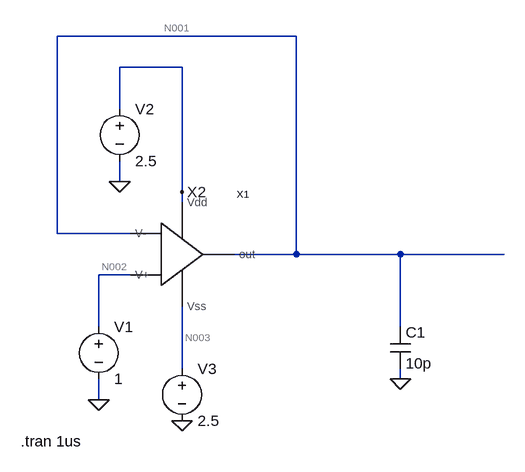
[diagram p0: schematic Draft7.asc]
Draft7.asc, the LTspice schematic file:
Version 4
SHEET 1 880 680
WIRE 400 -224 32 -224
WIRE 224 -176 128 -176
WIRE 128 -112 128 -176
WIRE 128 0 128 -32
WIRE 224 16 224 -176
WIRE 224 32 224 16
WIRE 32 80 32 -224
WIRE 144 80 32 80
WIRE 400 112 400 -224
WIRE 400 112 304 112
WIRE 560 112 400 112
WIRE 720 112 560 112
WIRE 144 144 96 144
WIRE 96 224 96 144
WIRE 560 224 560 112
WIRE 224 288 224 192
WIRE 560 304 560 288
WIRE 96 336 96 304
FLAG 96 336 0
FLAG 128 0 0
FLAG 224 368 0
FLAG 560 304 0
FLAG 224 16 X2
SYMBOL OPAMP 112 112 R0
SYMATTR InstName X1
SYMBOL voltage 96 208 R0
WINDOW 123 0 0 Left 0
WINDOW 39 0 0 Left 0
SYMATTR InstName V1
SYMATTR Value 1
SYMBOL voltage 128 -128 R0
WINDOW 123 0 0 Left 0
WINDOW 39 0 0 Left 0
SYMATTR InstName V2
SYMATTR Value 2.5
SYMBOL voltage 224 272 R0
WINDOW 123 0 0 Left 0
WINDOW 39 0 0 Left 0
SYMATTR InstName V3
SYMATTR Value 2.5
SYMBOL cap 544 224 R0
SYMATTR InstName C1
SYMATTR Value 10p
TEXT -24 400 Left 2 !.tran 1us

The netlist it stands for:
* Draft7.asc
XX1 X2 N003 N001 N002 N001 OPAMP  ; pins Vdd Vss V- V+ out
V1 N002 0 1
V2 X2 0 2.5
V3 N003 0 2.5
C1 N001 0 10p
.tran 1us
.backanno
.end

* Results of the author's LTspice run, read from the files saved beside the schematic
* Operating Point, zero values left out:
*   V(n001) = 2.5 V
*   V(n002) = 1 V
*   V(x2) = 2.5 V
*   V(n003) = 2.5 V
*   I(V2) = -30 µA
*   I(V3) = 30 µA
*   Ix(x1:VDD) = 30 µA
*   Ix(x1:VSS) = -30 µA